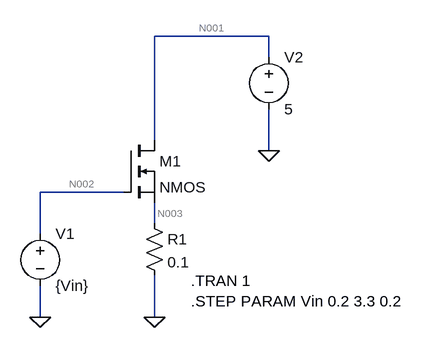
[diagram p0: schematic DRAFT3.asc]
DRAFT3.asc, the LTspice schematic file:
Version 4
SHEET 1 880 680
WIRE 464 -16 288 -16
WIRE 464 16 464 -16
WIRE 288 144 288 -16
WIRE 464 160 464 96
WIRE 240 224 112 224
WIRE 288 272 288 240
WIRE 112 288 112 224
WIRE 112 416 112 368
WIRE 288 416 288 352
FLAG 112 416 0
FLAG 288 416 0
FLAG 464 160 0
SYMBOL nmos 240 144 R0
SYMATTR InstName M1
SYMBOL voltage 112 272 R0
WINDOW 123 0 0 Left 0
WINDOW 39 0 0 Left 0
SYMATTR InstName V1
SYMATTR Value {Vin}
SYMBOL res 272 256 R0
SYMATTR InstName R1
SYMATTR Value 0.1
SYMBOL voltage 464 0 R0
WINDOW 123 0 0 Left 0
WINDOW 39 0 0 Left 0
SYMATTR InstName V2
SYMATTR Value 5
TEXT 344 392 Left 2 !.STEP PARAM Vin 0.2 3.3 0.2
TEXT 344 360 Left 2 !.TRAN 1

The netlist it stands for:
* DRAFT3.asc
M1 N001 N002 N003 N003 NMOS
V1 N002 0 {Vin}
R1 N003 0 0.1
V2 N001 0 5
.model NMOS NMOS
.model PMOS PMOS
.lib standard.mos
.STEP PARAM Vin 0.2 3.3 0.2
.TRAN 1
.backanno
.end

* Results of the author's LTspice run, read from the files saved beside the schematic
* Operating Point (first step), zero values left out:
*   vin = 200 m
*   V(n002) = 5 V
*   V(n003) = 200 mV
*   V(n001) = 5 V
*   Id(M1) = 400 nA
*   Ib(M1) = -5.01 pA
*   Is(M1) = -400 nA
*   I(R1) = 400 nA
*   I(V2) = -400 nA
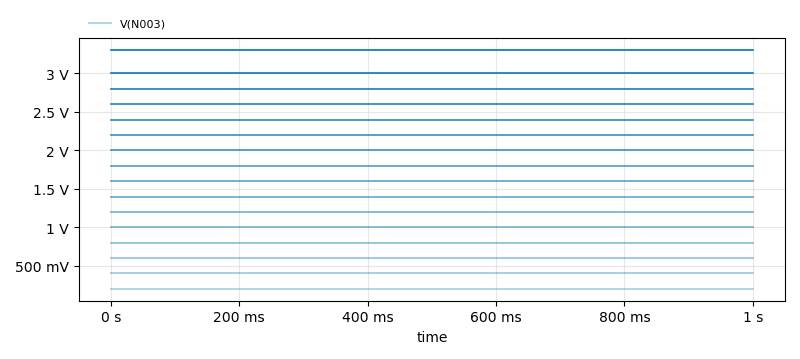
[diagram p1: Transient Analysis of DRAFT3.asc, plotted from the saved traces]
* Transient Analysis, 17 runs:
*   V(N003) [run 1]: min 200 mV, max 200 mV, average 200 mV, rms 200 mV, last 200 mV
*   V(N003) [run 2]: min 400 mV, max 400 mV, average 400 mV, rms 400 mV, last 400 mV
*   V(N003) [run 3]: min 600 mV, max 600 mV, average 600 mV, rms 600 mV, last 600 mV
*   V(N003) [run 4]: min 800 mV, max 800 mV, average 800 mV, rms 800 mV, last 800 mV
*   V(N003) [run 5]: min 1 V, max 1 V, average 1 V, rms 1 V, last 1 V
*   V(N003) [run 6]: min 1.2 V, max 1.2 V, average 1.2 V, rms 1.2 V, last 1.2 V
*   V(N003) [run 7]: min 1.4 V, max 1.4 V, average 1.4 V, rms 1.4 V, last 1.4 V
*   V(N003) [run 8]: min 1.6 V, max 1.6 V, average 1.6 V, rms 1.6 V, last 1.6 V